# EAGLE design lightBarV2_a (EAGLE 9.6.2)
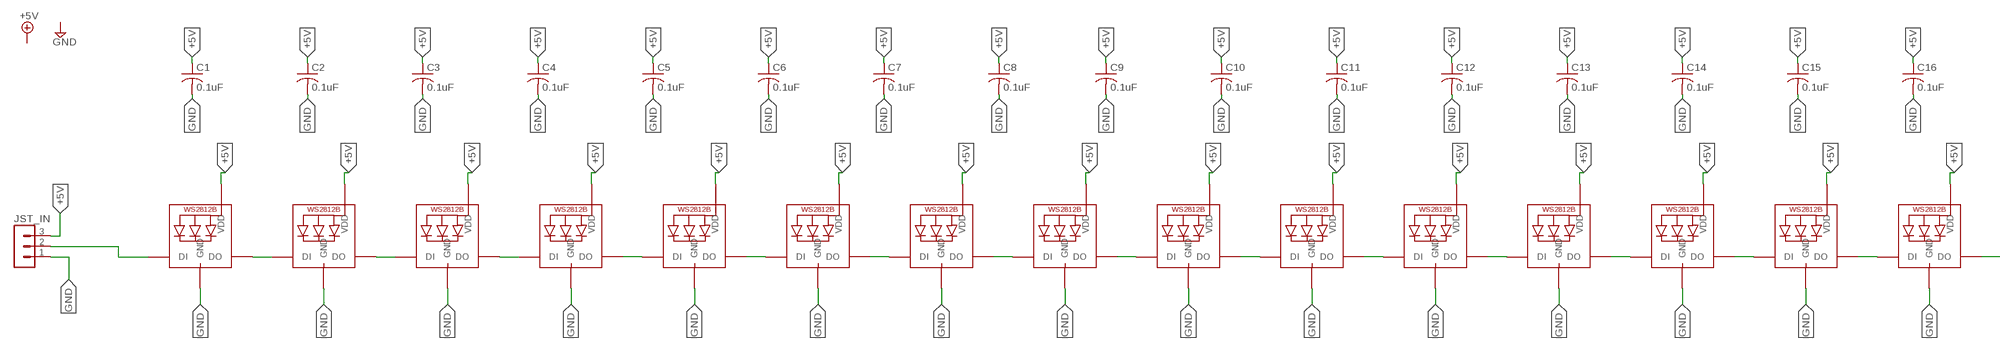
[diagram p0: schematic, sheet 1, part 1 of 2]
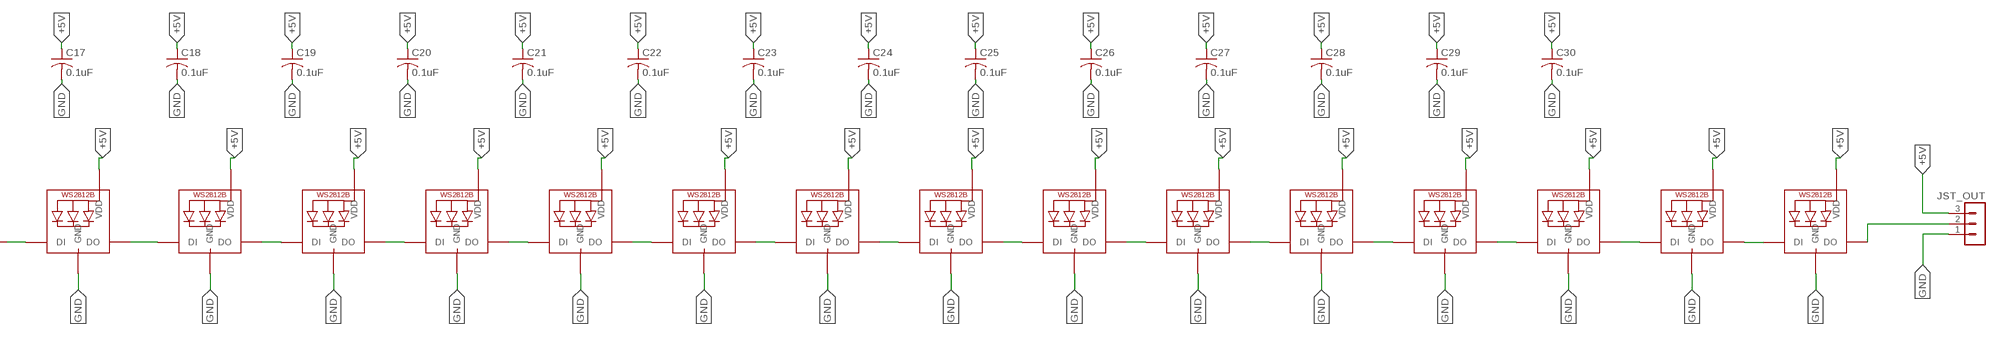
[diagram p1: schematic, sheet 1, part 2 of 2]

## Parts
C1  0.1uF  C-USC0805K  [C0805K]
C2  0.1uF  C-USC0805K  [C0805K]
C3  0.1uF  C-USC0805K  [C0805K]
C4  0.1uF  C-USC0805K  [C0805K]
C5  0.1uF  C-USC0805K  [C0805K]
C6  0.1uF  C-USC0805K  [C0805K]
C7  0.1uF  C-USC0805K  [C0805K]
C8  0.1uF  C-USC0805K  [C0805K]
C9  0.1uF  C-USC0805K  [C0805K]
C10  0.1uF  C-USC0805K  [C0805K]
C11  0.1uF  C-USC0805K  [C0805K]
C12  0.1uF  C-USC0805K  [C0805K]
C13  0.1uF  C-USC0805K  [C0805K]
C14  0.1uF  C-USC0805K  [C0805K]
C15  0.1uF  C-USC0805K  [C0805K]
C16  0.1uF  C-USC0805K  [C0805K]
C17  0.1uF  C-USC0805K  [C0805K]
C18  0.1uF  C-USC0805K  [C0805K]
C19  0.1uF  C-USC0805K  [C0805K]
C20  0.1uF  C-USC0805K  [C0805K]
C21  0.1uF  C-USC0805K  [C0805K]
C22  0.1uF  C-USC0805K  [C0805K]
C23  0.1uF  C-USC0805K  [C0805K]
C24  0.1uF  C-USC0805K  [C0805K]
C25  0.1uF  C-USC0805K  [C0805K]
C26  0.1uF  C-USC0805K  [C0805K]
C27  0.1uF  C-USC0805K  [C0805K]
C28  0.1uF  C-USC0805K  [C0805K]
C29  0.1uF  C-USC0805K  [C0805K]
C30  0.1uF  C-USC0805K  [C0805K]
JST_IN  B3B-XH-2  [B3B-XH-A]
JST_OUT  B3B-XH-2  [B3B-XH-A]
LED1  WS2812B5050  [WS2812B]
LED2  WS2812B5050  [WS2812B]
LED3  WS2812B5050  [WS2812B]
LED4  WS2812B5050  [WS2812B]
LED5  WS2812B5050  [WS2812B]
LED6  WS2812B5050  [WS2812B]
LED7  WS2812B5050  [WS2812B]
LED8  WS2812B5050  [WS2812B]
LED9  WS2812B5050  [WS2812B]
LED10  WS2812B5050  [WS2812B]
LED11  WS2812B5050  [WS2812B]
LED12  WS2812B5050  [WS2812B]
LED13  WS2812B5050  [WS2812B]
LED14  WS2812B5050  [WS2812B]
LED15  WS2812B5050  [WS2812B]
LED16  WS2812B5050  [WS2812B]
LED17  WS2812B5050  [WS2812B]
LED18  WS2812B5050  [WS2812B]
LED19  WS2812B5050  [WS2812B]
LED20  WS2812B5050  [WS2812B]
LED21  WS2812B5050  [WS2812B]
LED22  WS2812B5050  [WS2812B]
LED23  WS2812B5050  [WS2812B]
LED24  WS2812B5050  [WS2812B]
LED25  WS2812B5050  [WS2812B]
LED26  WS2812B5050  [WS2812B]
LED27  WS2812B5050  [WS2812B]
LED28  WS2812B5050  [WS2812B]
LED29  WS2812B5050  [WS2812B]
LED30  WS2812B5050  [WS2812B]

## Nets
+5V: C1.1 C2.1 C3.1 C4.1 C5.1 C6.1 C7.1 C8.1 C9.1 C10.1 C11.1 C12.1 C13.1 C14.1 C15.1 C16.1 C17.1 C18.1 C19.1 C20.1 C21.1 C22.1 C23.1 C24.1 C25.1 C26.1 C27.1 C28.1 C29.1 C30.1 JST_IN.3 JST_OUT.3 LED1.1-VDD(VDD) LED2.1-VDD(VDD) LED3.1-VDD(VDD) LED4.1-VDD(VDD) LED5.1-VDD(VDD) LED6.1-VDD(VDD) LED7.1-VDD(VDD) LED8.1-VDD(VDD) LED9.1-VDD(VDD) LED10.1-VDD(VDD) LED11.1-VDD(VDD) LED12.1-VDD(VDD) LED13.1-VDD(VDD) LED14.1-VDD(VDD) LED15.1-VDD(VDD) LED16.1-VDD(VDD) LED17.1-VDD(VDD) LED18.1-VDD(VDD) LED19.1-VDD(VDD) LED20.1-VDD(VDD) LED21.1-VDD(VDD) LED22.1-VDD(VDD) LED23.1-VDD(VDD) LED24.1-VDD(VDD) LED25.1-VDD(VDD) LED26.1-VDD(VDD) LED27.1-VDD(VDD) LED28.1-VDD(VDD) LED29.1-VDD(VDD) LED30.1-VDD(VDD)
GND: C1.2 C2.2 C3.2 C4.2 C5.2 C6.2 C7.2 C8.2 C9.2 C10.2 C11.2 C12.2 C13.2 C14.2 C15.2 C16.2 C17.2 C18.2 C19.2 C20.2 C21.2 C22.2 C23.2 C24.2 C25.2 C26.2 C27.2 C28.2 C29.2 C30.2 JST_IN.1 JST_OUT.1 LED1.3-GND(GND) LED2.3-GND(GND) LED3.3-GND(GND) LED4.3-GND(GND) LED5.3-GND(GND) LED6.3-GND(GND) LED7.3-GND(GND) LED8.3-GND(GND) LED9.3-GND(GND) LED10.3-GND(GND) LED11.3-GND(GND) LED12.3-GND(GND) LED13.3-GND(GND) LED14.3-GND(GND) LED15.3-GND(GND) LED16.3-GND(GND) LED17.3-GND(GND) LED18.3-GND(GND) LED19.3-GND(GND) LED20.3-GND(GND) LED21.3-GND(GND) LED22.3-GND(GND) LED23.3-GND(GND) LED24.3-GND(GND) LED25.3-GND(GND) LED26.3-GND(GND) LED27.3-GND(GND) LED28.3-GND(GND) LED29.3-GND(GND) LED30.3-GND(GND)
N$1: LED29.2-DOUT(DO) LED30.4-DIN(DI)
N$2: LED28.2-DOUT(DO) LED29.4-DIN(DI)
N$3: LED27.2-DOUT(DO) LED28.4-DIN(DI)
N$4: LED26.2-DOUT(DO) LED27.4-DIN(DI)
N$5: LED25.2-DOUT(DO) LED26.4-DIN(DI)
N$6: LED24.2-DOUT(DO) LED25.4-DIN(DI)
N$7: LED23.2-DOUT(DO) LED24.4-DIN(DI)
N$8: LED22.2-DOUT(DO) LED23.4-DIN(DI)
N$9: LED21.2-DOUT(DO) LED22.4-DIN(DI)
N$10: LED20.2-DOUT(DO) LED21.4-DIN(DI)
N$11: LED19.2-DOUT(DO) LED20.4-DIN(DI)
N$12: LED18.2-DOUT(DO) LED19.4-DIN(DI)
N$13: LED17.2-DOUT(DO) LED18.4-DIN(DI)
N$14: LED16.2-DOUT(DO) LED17.4-DIN(DI)
N$15: LED15.2-DOUT(DO) LED16.4-DIN(DI)
N$16: LED14.2-DOUT(DO) LED15.4-DIN(DI)
N$17: LED13.2-DOUT(DO) LED14.4-DIN(DI)
N$18: LED12.2-DOUT(DO) LED13.4-DIN(DI)
N$19: LED11.2-DOUT(DO) LED12.4-DIN(DI)
N$20: LED10.2-DOUT(DO) LED11.4-DIN(DI)
N$21: LED9.2-DOUT(DO) LED10.4-DIN(DI)
N$22: LED8.2-DOUT(DO) LED9.4-DIN(DI)
N$23: LED7.2-DOUT(DO) LED8.4-DIN(DI)
N$24: LED6.2-DOUT(DO) LED7.4-DIN(DI)
N$25: LED5.2-DOUT(DO) LED6.4-DIN(DI)
N$26: LED4.2-DOUT(DO) LED5.4-DIN(DI)
N$27: LED3.2-DOUT(DO) LED4.4-DIN(DI)
N$28: LED1.2-DOUT(DO) LED2.4-DIN(DI)
N$29: LED2.2-DOUT(DO) LED3.4-DIN(DI)
N$30: JST_IN.2 LED1.4-DIN(DI)
N$31: JST_OUT.2 LED30.2-DOUT(DO)

## Library data of the parts
C1-C30 = rcl:C-US: CAPACITOR, American symbol; SPICEPREFIX: C
JST_IN JST_OUT = con-JST XH:B3B-XH: JST XH series header 2.50mm pitch disconnectable crimp style connectors, vertical (side entry type), 3 pins
LED1-LED30 = adafruit:WS2812B

## Board
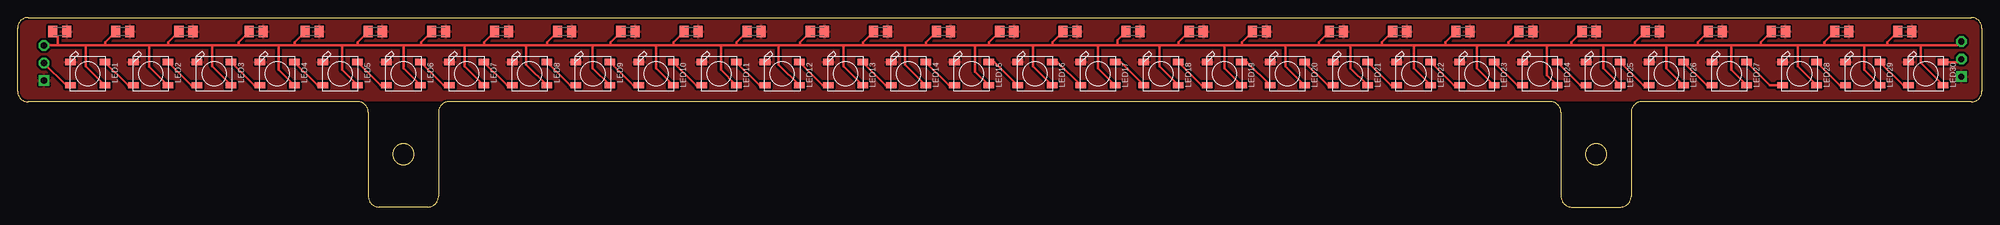
[diagram p2: board, top side]
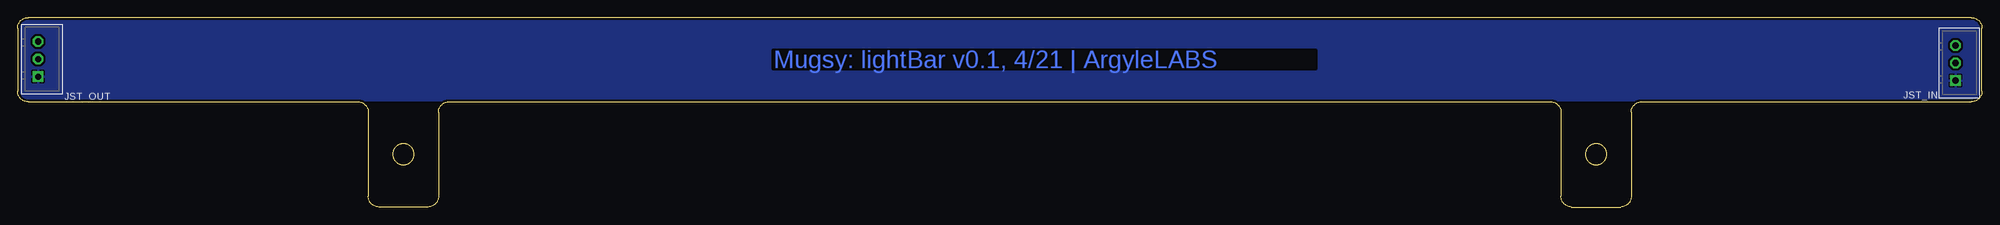
[diagram p3: board, bottom side, seen from below]

Size 280 x 27 mm. Coordinates in mm from the lower left corner, seen from the top.
Outline: 220,13.5 220,1.5 arc90 221.5,0 228.5,0 arc90 230,1.5 230,13.5 arc-90 231.5,15 278.5,15 arc90 280,16.5 280,25.5 arc90 278.5,27 1.5,27 arc90 0,25.5 0,16.5 arc90 1.5,15 48.5,15 arc-90 50,13.5 50,1.5 arc90 51.5,0 58.5,0 arc90 60,1.5 60,13.5 arc-90 61.5,15 218.5,15 arc-90 220,13.5
Outline: circle at 225,7.5 radius 1.5
Outline: circle at 55,7.5 radius 1.5
Copper layers (1*16): Top 0.035mm / dielectric 1.5mm / Bottom 0.035mm
Design rules "default *": minimum track width 6mil, minimum drill 0.35mm, track to track 6mil, track to pad 6mil, pad to pad 6mil, via to via 6mil, smd to smd 6mil, copper to edge 12mil, drill to drill 6mil, minimum pad ring 10mil, minimum via ring 8mil, stop-mask expansion 4mil, vias tented up to drill 0mil, thermal gap 10mil
Holes 3 mm at 55,7.5 225,7.5

### Footprints (pad centres in the part's own frame; a part is rotated, then mirrored left to right if it is on the bottom)
C0805K = smd 1.3 x 1.6: 1 -1,0; 2 1,0
B3B-XH-A = drill 0.9 pad 1.5 square: 1 2.5,0 | drill 0.9 pad 1.5 octagon: 2 0,0; 3 -2.5,0
WS2812B = smd 1.5 x 0.9: 1-VDD 2.45,-1.65; 2-DOUT 2.45,1.65; 3-GND -2.45,1.65; 4-DIN -2.45,-1.65

### Placement (x,y rotation side)
C1  6,25 0 top
C2  15,25 0 top
C3  24,25 0 top
C4  34,25 0 top
C5  42,25 0 top
C6  51,25 0 top
C7  60,25 0 top
C8  69,25 0 top
C9  78,25 0 top
C10  87,25 0 top
C11  96,25 0 top
C12  105,25 0 top
C13  114,25 0 top
C14  123,25 0 top
C15  132,25 0 top
C16  141,25 0 top
C17  150,25 0 top
C18  159,25 0 top
C19  168,25 0 top
C20  177,25 0 top
C21  188,25 0 top
C22  197,25 0 top
C23  206,25 0 top
C24  215,25 0 top
C25  224,25 0 top
C26  233,25 0 top
C27  242,25 0 top
C28  251,25 0 top
C29  260,25 0 top
C30  269,25 0 top
JST_IN  3.75,20.52 270 bottom
JST_OUT  277.06,21.07 270 bottom
LED1  10,19 0 top
LED2  19,19 0 top
LED3  28,19 0 top
LED4  37,19 0 top
LED5  46,19 0 top
LED6  55,19 0 top
LED7  64,19 0 top
LED8  73,19 0 top
LED9  82,19 0 top
LED10  91,19 0 top
LED11  100,19 0 top
LED12  109,19 0 top
LED13  118,19 0 top
LED14  127,19 0 top
LED15  136,19 0 top
LED16  145,19 0 top
LED17  154,19 0 top
LED18  163,19 0 top
LED19  172,19 0 top
LED20  181,19 0 top
LED21  190,19 0 top
LED22  199,19 0 top
LED23  208,19 0 top
LED24  217,19 0 top
LED25  226,19 0 top
LED26  235,19 0 top
LED27  244,19 0 top
LED28  254,19 0 top
LED29  263,19 0 top
LED30  272,19 0 top

### Tracks (layer width: path | path; a pad name or v marks a point on that pad's centre or on a via)
+5V
  Top 0.356: JST_IN.3 5.75,23.02 | 5.75,23.02 9.75,23.02 | 9.75,23.02 12.5,23.02 | 12.5,23.02 18.75,23.02 | 18.75,23.02 21.5,23.02 | 21.5,23.02 27.75,23.02 | 27.75,23.02 31.5,23.02 | 31.5,23.02 37.25,23.02 | 37.25,23.02 39.5,23.02 | 39.5,23.02 46.25,23.02 | 46.25,23.02 48.5,23.02 | 48.5,23.02 55,23.02 | 55,23.02 57.5,23.02 | 57.5,23.02 63.75,23.02 | 63.75,23.02 66.5,23.02 | 66.5,23.02 72.5,23.02 | 72.5,23.02 75.5,23.02 | 75.5,23.02 82,23.02 | 82,23.02 84.5,23.02 | 84.5,23.02 91,23.02 | 91,23.02 93.5,23.02 | 93.5,23.02 100.25,23.02 | 100.25,23.02 102.5,23.02 | 102.5,23.02 108.5,23.02 | 108.5,23.02 111.5,23.02 | 111.5,23.02 117.75,23.02 | 117.75,23.02 120.5,23.02 | 120.5,23.02 126.5,23.02 | 126.5,23.02 129.5,23.02 | 129.5,23.02 136.5,23.02 | 136.5,23.02 138.5,23.02 | 138.5,23.02 144.75,23.02 | 144.75,23.02 147.5,23.02 | 147.5,23.02 154,23.02 | 154,23.02 156.75,23.02 | 156.75,23.02 162.75,23.02 | 162.75,23.02 165.5,23.02 | 165.5,23.02 172,23.02 | 172,23.02 174.5,23.02 | 174.5,23.02 180.75,23.02 | 180.75,23.02 185.5,23.02 | 185.5,23.02 190,23.02 | 190,23.02 194.5,23.02 | 194.5,23.02 199,23.02 | 199,23.02 203.5,23.02 | 203.5,23.02 208,23.02 | 208,23.02 212.5,23.02 | 212.5,23.02 218,23.02 | 218,23.02 221.5,23.02 | 221.5,23.02 226,23.02 | 226,23.02 230.5,23.02 | 230.5,23.02 235,23.02 | 235,23.02 239.5,23.02 | 239.5,23.02 244.25,23.02 | 244.25,23.02 248.5,23.02 | 248.5,23.02 253.75,23.02 | 253.75,23.02 257.5,23.02 | 257.5,23.02 263.25,23.02 | 263.25,23.02 266.5,23.02 | 266.5,23.02 271.25,23.02 | 271.25,23.02 276.51,23.02 JST_OUT.3 | C1.1 5.75,24.25 5.75,23.02 | C2.1 12.5,23.5 12.5,23.02 | C3.1 21.5,23.5 21.5,23.02 | C4.1 31.5,23.5 31.5,23.02 | C5.1 39.5,23.5 39.5,23.02 | C6.1 48.5,23.5 48.5,23.02
  Top 0.356: C7.1 57.5,23.5 57.5,23.02 | C8.1 66.5,23.5 66.5,23.02 | C9.1 75.5,23.5 75.5,23.02 | C10.1 84.5,23.5 84.5,23.02 | C11.1 93.5,23.5 93.5,23.02 | C12.1 102.5,23.5 102.5,23.02 | C13.1 111.5,23.5 111.5,23.02 | C14.1 120.5,23.5 120.5,23.02 | C15.1 129.5,23.5 129.5,23.02 | C16.1 138.5,23.5 138.5,23.02 | C17.1 147.5,23.5 147.5,23.02 | C18.1 156.75,23.75 156.75,23.02 | C19.1 165.5,23.5 165.5,23.02 | C20.1 174.5,23.5 174.5,23.02 | C21.1 185.5,23.5 185.5,23.02 | C22.1 194.5,23.5 194.5,23.02 | C23.1 203.5,23.5 203.5,23.02 | C24.1 212.5,23.5 212.5,23.02 | C25.1 221.5,23.5 221.5,23.02 | C26.1 230.5,23.5 230.5,23.02 | C27.1 239.5,23.5 239.5,23.02 | C28.1 248.5,23.5 248.5,23.02 | C29.1 257.5,23.5 257.5,23.02 | C30.1 266.5,23.5 266.5,23.02 | LED1.1-VDD 9.75,20.05 9.75,23.02 | 18.75,23.02 18.75,20 21.4,17.35 LED2.1-VDD | LED3.1-VDD 27.75,20.05 27.75,23.02 | LED4.1-VDD 37.25,19.55 37.25,23.02 | LED5.1-VDD 46.25,19.55 46.25,23.02 | LED6.1-VDD 55,19.8 55,23.02 | LED7.1-VDD 63.75,20.05 63.75,23.02 | LED8.1-VDD 72.5,20.3 72.5,23.02 | 82,23.02 82,19.8 LED9.1-VDD | LED10.1-VDD 91,19.8 91,23.02 | LED11.1-VDD 100.25,19.55 100.25,23.02 | LED12.1-VDD 108.5,20.3 108.5,23.02 | LED13.1-VDD 117.75,20.05 117.75,23.02 | LED14.1-VDD 126.5,20.3 126.5,23.02 | LED15.1-VDD 136.5,19.3 136.5,23.02 | LED16.1-VDD 144.75,20.05 144.75,23.02 | LED17.1-VDD 154,19.8 154,23.02 | LED18.1-VDD 162.75,20.05 162.75,23.02 | LED19.1-VDD 172,19.8 172,23.02 | LED20.1-VDD 180.75,20.05 180.75,23.02 | LED21.1-VDD 190,19.8 190,23.02 | LED22.1-VDD 199,19.8 199,23.02 | LED23.1-VDD 208,19.8 208,23.02 | LED24.1-VDD 218,18.8 218,23.02 | LED25.1-VDD 226,19.8 226,23.02 | LED26.1-VDD 235,19.8 235,23.02
  Top 0.356: LED27.1-VDD 244.25,19.55 244.25,23.02 | LED28.1-VDD 253.75,20.05 253.75,23.02 | LED29.1-VDD 263.25,19.55 263.25,23.02 | LED30.1-VDD 271.25,20.55 271.25,23.02
GND
  pour Top: 8.75,15.25 1,15.25 0.5,15.75 0.25,16 0.25,16.5 0.25,25.75 0.5,26 1.25,26.75 1.5,26.75 279,26.75 279.75,26 279.75,16 279,15.25 278.25,15.25
  pour Bottom: 2.5,15.25 1,15.25 0.75,15.5 0.25,16 0.25,25.75 1.25,26.75 279,26.75 279.75,26 279.75,16 279.5,15.75 279,15.25 277,15.25
N$1
  Top 0.356: LED29.2-DOUT 268.75,17.35 LED30.4-DIN
N$2
  Top 0.356: LED28.2-DOUT 259.75,17.35 LED29.4-DIN
N$3
  Top 0.356: LED27.2-DOUT 249.75,17.35 LED28.4-DIN
N$4
  Top 0.356: LED26.2-DOUT 240.75,17.35 LED27.4-DIN
N$5
  Top 0.356: LED25.2-DOUT 231.75,17.35 LED26.4-DIN
N$6
  Top 0.356: LED24.2-DOUT 222.75,17.35 LED25.4-DIN
N$7
  Top 0.356: LED23.2-DOUT 213.75,17.35 LED24.4-DIN
N$8
  Top 0.356: LED22.2-DOUT 204.75,17.35 LED23.4-DIN
N$9
  Top 0.356: LED21.2-DOUT 195.75,17.35 LED22.4-DIN
N$10
  Top 0.356: LED20.2-DOUT 186.75,17.35 LED21.4-DIN
N$11
  Top 0.356: LED19.2-DOUT 175.25,20.65 LED20.4-DIN
N$12
  Top 0.356: LED18.2-DOUT 168.75,17.35 LED19.4-DIN
N$13
  Top 0.356: LED17.2-DOUT 157.25,20.65 LED18.4-DIN
N$14
  Top 0.356: LED16.2-DOUT 148.25,20.65 LED17.4-DIN
N$15
  Top 0.356: LED15.2-DOUT 139.25,20.65 LED16.4-DIN
N$16
  Top 0.356: LED14.2-DOUT 132.75,17.35 LED15.4-DIN
N$17
  Top 0.356: LED13.2-DOUT 123.75,17.35 LED14.4-DIN
N$18
  Top 0.356: LED12.2-DOUT 114.75,17.35 LED13.4-DIN
N$19
  Top 0.356: LED11.2-DOUT 105.75,17.35 LED12.4-DIN
N$20
  Top 0.356: LED10.2-DOUT 96.75,17.35 LED11.4-DIN
N$21
  Top 0.356: LED9.2-DOUT 87.75,17.35 LED10.4-DIN
N$22
  Top 0.356: LED8.2-DOUT 78.75,17.35 LED9.4-DIN
N$23
  Top 0.356: LED7.2-DOUT 69.75,17.35 LED8.4-DIN
N$24
  Top 0.356: LED6.2-DOUT 60.75,17.35 LED7.4-DIN
N$25
  Top 0.356: LED5.2-DOUT 51.75,17.35 LED6.4-DIN
N$26
  Top 0.356: LED4.2-DOUT 42.75,17.35 LED5.4-DIN
N$27
  Top 0.356: LED3.2-DOUT 33.75,17.35 LED4.4-DIN
N$28
  Top 0.356: LED1.2-DOUT 15.75,17.35 LED2.4-DIN
N$29
  Top 0.356: LED2.2-DOUT 24.75,17.35 LED3.4-DIN
N$30
  Top 0.356: JST_IN.2 6.92,17.35 LED1.4-DIN
N$31
  Top 0.356: LED30.2-DOUT 276.64,20.65 JST_OUT.2

### Text on the board
Bottom: Mugsy: lightBar v0.1, 4/21 | ArgyleLABS